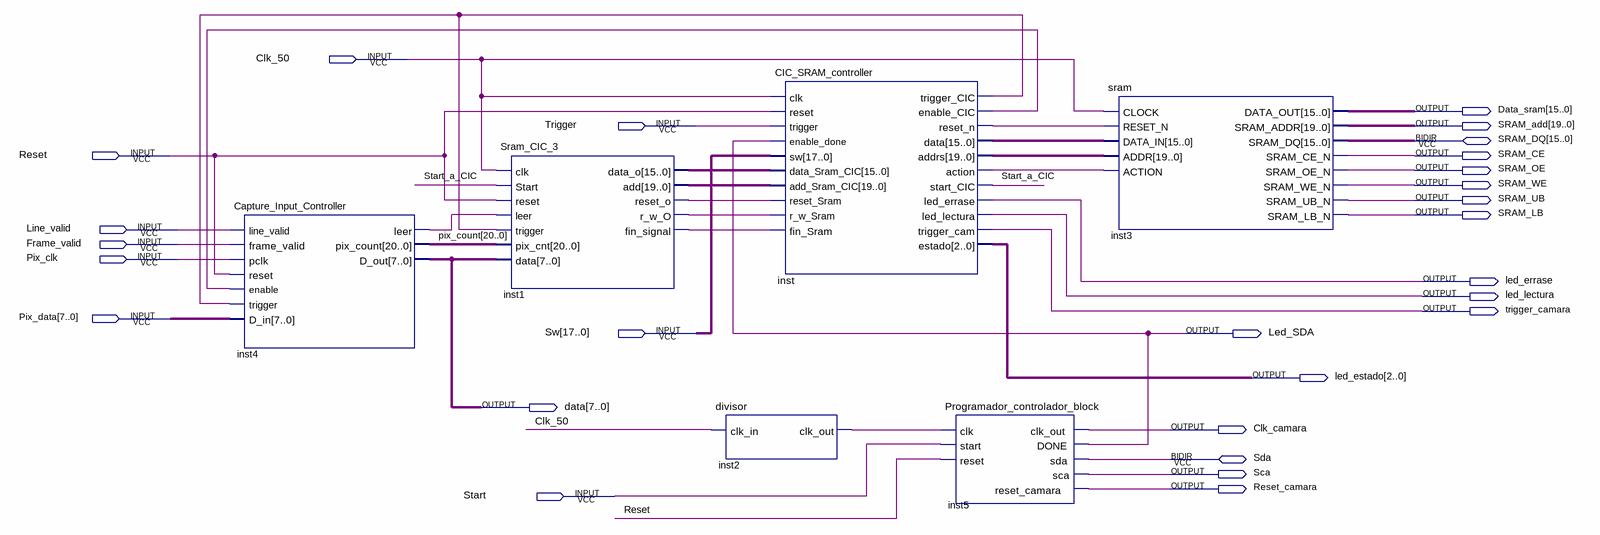
[diagram p0: schematic sheet]
// Quartus schematic todo_junto_optimizado.bdf as structural Verilog: 6 symbols, 27 pins
module todo_junto_optimizado (
  input  Clk_50,
  input  Trigger,
  input  Reset,
  input  Line_valid,
  input  Frame_valid,
  input  Pix_clk,
  input  [7:0] Pix_data,
  input  [17:0] Sw,
  input  Start,
  inout  [15:0] SRAM_DQ,
  inout  Sda,
  output [15:0] Data_sram,
  output [19:0] SRAM_add,
  output SRAM_CE,
  output SRAM_OE,
  output SRAM_WE,
  output SRAM_UB,
  output SRAM_LB,
  output led_errase,
  output led_lectura,
  output trigger_camara,
  output Led_SDA,
  output [2:0] led_estado,
  output [7:0] data,
  output Clk_camara,
  output Sca,
  output Reset_camara
);

  wire inst1_fin_signal, inst1_r_w_o, inst1_reset_o, inst2_clk_out, inst4_leer, inst_action, inst_enable_cic,
       inst_reset_n, inst_trigger_cic, Start_a_CIC;
  wire [15:0] inst1_data_o, inst_data;
  wire [19:0] inst1_add, inst_addrs;
  wire [20:0] pix_count;

  Capture_Input_Controller inst4 (
    .line_valid(Line_valid), .frame_valid(Frame_valid), .pclk(Pix_clk), .reset(Reset),
    .enable(inst_enable_cic), .trigger(inst_trigger_cic), .D_in(Pix_data), .leer(inst4_leer),
    .pix_count(pix_count), .D_out(data));
  Sram_CIC_3 inst1 (
    .clk(Clk_50), .Start(Start_a_CIC), .reset(Reset), .leer(inst4_leer), .trigger(inst_trigger_cic),
    .pix_cnt(pix_count), .data(data), .data_o(inst1_data_o), .add(inst1_add), .reset_o(inst1_reset_o),
    .r_w_O(inst1_r_w_o), .fin_signal(inst1_fin_signal));
  divisor inst2 (.clk_in(Clk_50), .clk_out(inst2_clk_out));
  CIC_SRAM_controller inst (
    .clk(Clk_50), .reset(Reset), .trigger(Trigger), .enable_done(Led_SDA), .sw(Sw),
    .data_Sram_CIC(inst1_data_o), .add_Sram_CIC(inst1_add), .reset_Sram(inst1_reset_o),
    .r_w_Sram(inst1_r_w_o), .fin_Sram(inst1_fin_signal), .trigger_CIC(inst_trigger_cic),
    .enable_CIC(inst_enable_cic), .reset_n(inst_reset_n), .data(inst_data), .addrs(inst_addrs),
    .action(inst_action), .start_CIC(Start_a_CIC), .led_errase(led_errase), .led_lectura(led_lectura),
    .trigger_cam(trigger_camara), .estado(led_estado));
  Programador_controlador_block inst5 (
    .clk(inst2_clk_out), .start(Start), .reset(Reset), .clk_out(Clk_camara), .DONE(Led_SDA), .sca(Sca),
    .reset_camara(Reset_camara), .sda(Sda));
  sram inst3 (
    .CLOCK(Clk_50), .RESET_N(inst_reset_n), .DATA_IN(inst_data), .ADDR(inst_addrs), .ACTION(inst_action),
    .DATA_OUT(Data_sram), .SRAM_ADDR(SRAM_add), .SRAM_CE_N(SRAM_CE), .SRAM_OE_N(SRAM_OE),
    .SRAM_WE_N(SRAM_WE), .SRAM_UB_N(SRAM_UB), .SRAM_LB_N(SRAM_LB), .SRAM_DQ(SRAM_DQ));
endmodule
